# EAGLE design Train Servo Mark II (EAGLE 9.6.1)
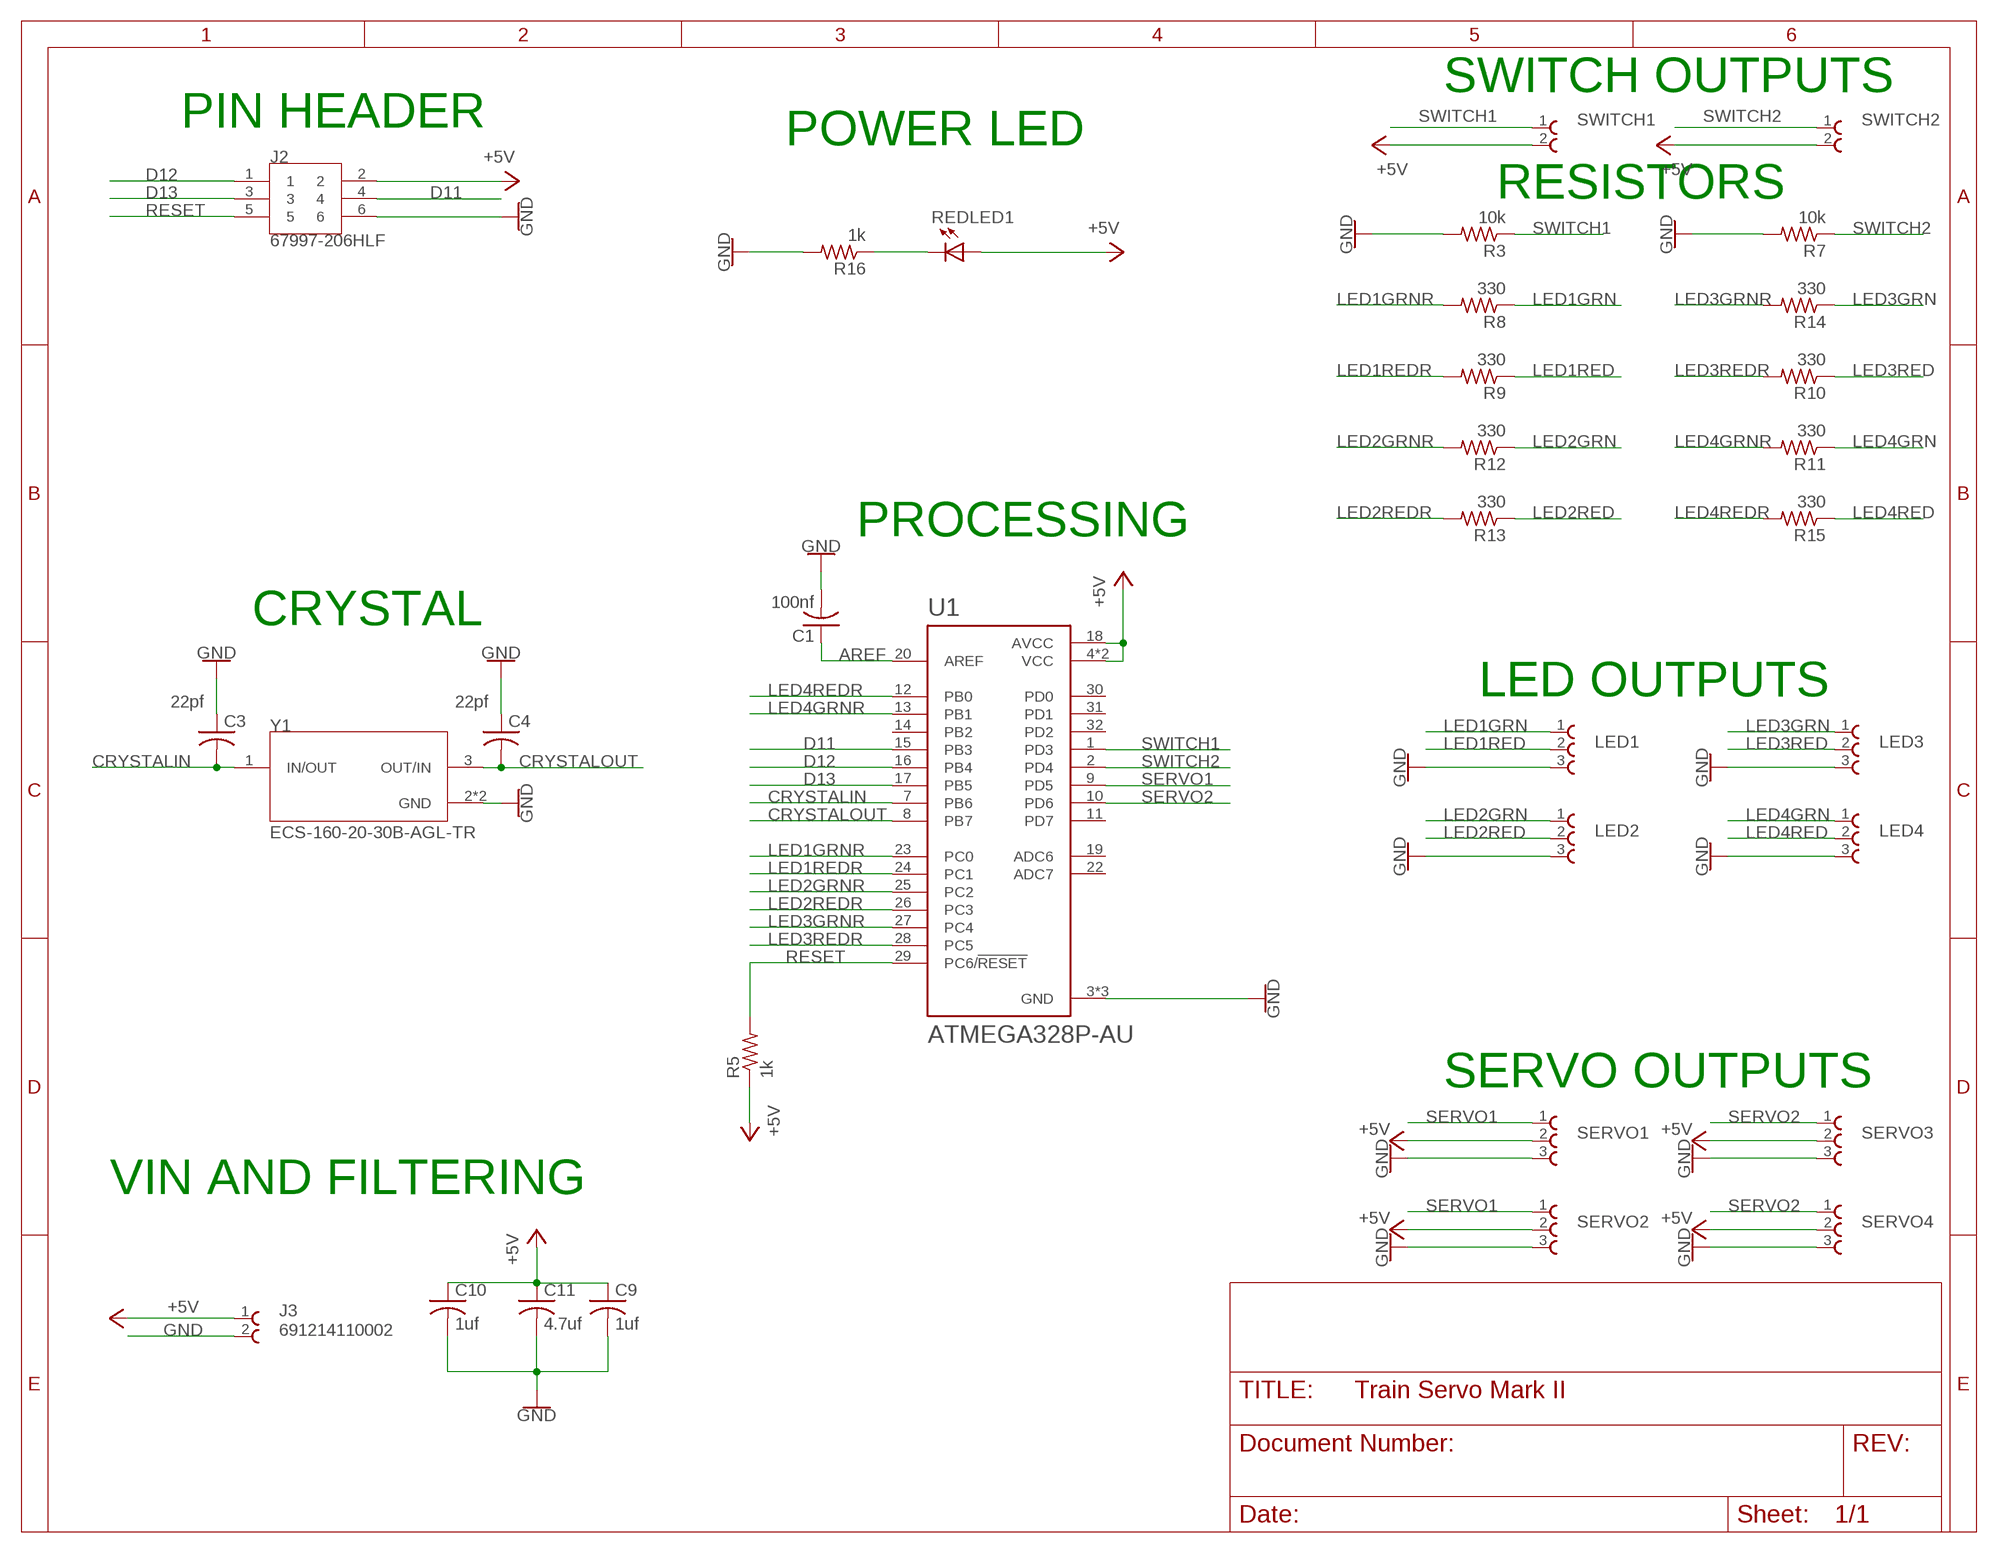
[diagram p0: schematic, sheet 1]

## Parts
C1  100nf  C-USC0805  [C0805]
C3  22pf  C-USC0805  [C0805]
C4  22pf  C-USC0805  [C0805]
C9  1uf  C-USC0805  [C0805]
C10  1uf  C-USC0805  [C0805]
C11  4.7uf  C-USC1206K  [C1206K]
J2  67997-206HLF  [FRAMATOME_67997-206HLF]
J3  691214110002  [691214110002]
LED1  691214110003  [691214110003]
LED2  691214110003  [691214110003]
LED3  691214110003  [691214110003]
LED4  691214110003  [691214110003]
R3  10k  R-US_M0805  [M0805]
R5  1k  R-US_M0805  [M0805]
R7  10k  R-US_M0805  [M0805]
R8  330  R-US_M0805  [M0805]
R9  330  R-US_M0805  [M0805]
R10  330  R-US_M0805  [M0805]
R11  330  R-US_M0805  [M0805]
R12  330  R-US_M0805  [M0805]
R13  330  R-US_M0805  [M0805]
R14  330  R-US_M0805  [M0805]
R15  330  R-US_M0805  [M0805]
R16  1k  R-US_M0805  [M0805]
REDLED1  LTST-C171KGKT  [DIOC200X125X110]
SERVO1  691214110003  [691214110003]
SERVO2  691214110003  [691214110003]
SERVO3  691214110003  [691214110003]
SERVO4  691214110003  [691214110003]
SWITCH1  691214110002  [691214110002]
SWITCH2  691214110002  [691214110002]
U1  ATMEGA328P-AU  [QFP80P900X900X120-32N]
Y1  ECS-160-20-30B-AGL-TR  [XTAL_ECS-160-20-30B-AGL-TR]

## Nets
+5V: C9.1 C10.1 C11.1 J2.2 J3.1 R5.1 REDLED1.+ SERVO1.2 SERVO2.2 SERVO3.2 SERVO4.2 SWITCH1.2 SWITCH2.2 U1.4(VCC) U1.6(VCC) U1.18(AVCC)
AREF: C1.1 U1.20(AREF)
CRYSTALIN: C3.2 U1.7(PB6) Y1.1(IN/OUT)
CRYSTALOUT: C4.2 U1.8(PB7) Y1.3(OUT/IN)
D11: J2.4 U1.15(PB3)
D12: J2.1 U1.16(PB4)
D13: J2.3 U1.17(PB5)
GND: C1.2 C3.1 C4.1 C9.2 C10.2 C11.2 J2.6 J3.2 LED1.3 LED2.3 LED3.3 LED4.3 R3.2 R7.2 R16.2 SERVO1.3 SERVO2.3 SERVO3.3 SERVO4.3 U1.3(GND) U1.5(GND) U1.21(GND) Y1.2(GND) Y1.4(GND)
LED1GRN: LED1.1 R8.1
LED1GRNR: R8.2 U1.23(PC0)
LED1RED: LED1.2 R9.1
LED1REDR: R9.2 U1.24(PC1)
LED2GRN: LED2.1 R12.1
LED2GRNR: R12.2 U1.25(PC2)
LED2RED: LED2.2 R13.1
LED2REDR: R13.2 U1.26(PC3)
LED3GRN: LED3.1 R14.1
LED3GRNR: R14.2 U1.27(PC4)
LED3RED: LED3.2 R10.1
LED3REDR: R10.2 U1.28(PC5)
LED4GRN: LED4.1 R11.1
LED4GRNR: R11.2 U1.13(PB1)
LED4RED: LED4.2 R15.1
LED4REDR: R15.2 U1.12(PB0)
N$3: R16.1 REDLED1.-
RESET: J2.5 R5.2 U1.29(PC6/!RESET)
SERVO1: SERVO1.1 SERVO2.1 U1.9(PD5)
SERVO2: SERVO3.1 SERVO4.1 U1.10(PD6)
SWITCH1: R3.1 SWITCH1.1 U1.1(PD3)
SWITCH2: R7.1 SWITCH2.1 U1.2(PD4)
Unconnected: U1.11(PD7) U1.14(PB2) U1.19(ADC6) U1.22(ADC7) U1.30(PD0) U1.31(PD1) U1.32(PD2)

## Notes on the sheet
- SWITCH OUTPUTS
- PIN HEADER
- POWER LED
- RESISTORS
- PROCESSING
- CRYSTAL
- LED OUTPUTS
- SERVO OUTPUTS
- VIN AND FILTERING

## Library data of the parts
C1 C3 C4 C9-C11 = adafruit:C-US: CAPACITOR, American symbol
J2 = 67997-206HLF:67997-206HLF: Conn; Rect; UnshroudedHdr; 6Cnts; ThruHole; BergStik; 2.54mmPin-Spng; Vert; DblRow; AVAILABILITY: Unavailable; DESCRIPTION: Connector Header Through Hole 6 position 0.100 _2.54mm_; MF: Amphenol ICC; MP: 67997-206HLF; PACKAGE: None; PRICE: None
J3 SWITCH1 SWITCH2 = 691214110002:691214110002: WR-TBL Serie 2141 - 3.5mm Horizontal Entry Modular with Rising Cage Clamp - 1.3 mm2 Wires, 2 Pins=>Code : Con_TBL_Screw_RisingClamp_3.50_691214110002 <http://katalog.we-online.de/media/images/eican/Con_TBL_Screw_RisingClamp_3.50_6912141100xx_pf2.jpg> Details see: http://katalog.we-online.de/en/em/TBL_3_50_2141_HORIZONTAL_ENTRY_MODULAR_69121411000X Created 2014-06-18, Karrer Zheng 2014 (C) Würth Elektronik; AVAILABILITY: Unavailable; DESCRIPTION: 2 Position Wire to Board Terminal Block Horizontal with Board 0.138 _3.50mm_ Through Hole; MF: Wurth Electronics; MP: 691214110002; PACKAGE: None; PRICE: None
LED1-LED4 SERVO1-SERVO4 = 691214110003:691214110003: WR-TBL Serie 2141 - 3.5mm Horizontal Entry Modular with Rising Cage Clamp - 1.3 mm2 Wires, 3 Pins=>Code : Con_TBL_Screw_RisingClamp_3.50_691214110003 <http://katalog.we-online.de/media/images/eican/Con_TBL_Screw_RisingClamp_3.50_6912141100xx_pf2.jpg> Details see: http://katalog.we-online.de/en/em/TBL_3_50_2141_HORIZONTAL_ENTRY_MODULAR_69121411000X Created 2014-06-18, Karrer Zheng 2014 (C) Würth Elektronik; AVAILABILITY: Unavailable; DESCRIPTION: 3 Position Wire to Board Terminal Block Horizontal with Board 0.138 _3.50mm_ Through Hole; MF: Wurth Electronics; MP: 691214110003; PACKAGE: None; PRICE: None
R3 R5 R7-R16 = adafruit:R-US_: RESISTOR, American symbol
REDLED1 = LTST-C171KGKT:LTST-C171KGKT: Green 2 x 1.25 x 1.1 mm 130° Water Clear 35 mcd 2 V Surface Mount LED; AVAILABILITY: Unavailable; DESCRIPTION: Green 571nm LED Indication - Discrete 2V 0805 _2012 Metric_; MF: Lite-On Inc.; MP: LTST-C171KGKT; PACKAGE: 0805 Diodes Inc.; PRICE: None
U1 = ATMEGA328P-AU:ATMEGA328P-AU: ATmega Series 20 MHz 32 KB Flash 2 KB SRAM 8-Bit Microcontroller - TQFP-32; AVAILABILITY: Unavailable; DESCRIPTION: AVR AVR® ATmega Microcontroller IC 8-Bit 20MHz 32KB _16K x 16_ FLASH 32-TQFP _7x7_; MF: Microchip; MP: ATMEGA328P-AU; PACKAGE: TQFP-32 Microchip; PRICE: None
Y1 = ECS-160-20-30B-AGL-TR:ECS-160-20-30B-AGL-TR: The ECX-53B is a miniature SMD Crystal with a 3.2 x 5 mm footprint. This package is ideal for todays compact wireless applications where board space is critical.; AVAILABILITY: Unavailable; DESCRIPTION: 16MHz ±25ppm Crystal 20pF 50 Ohms 4-SMD, No Lead; MF: ECS Inc.; MP: ECS-160-20-30B-AGL-TR; PACKAGE: SMD-4 ECS Inc.; PRICE: None

## Board
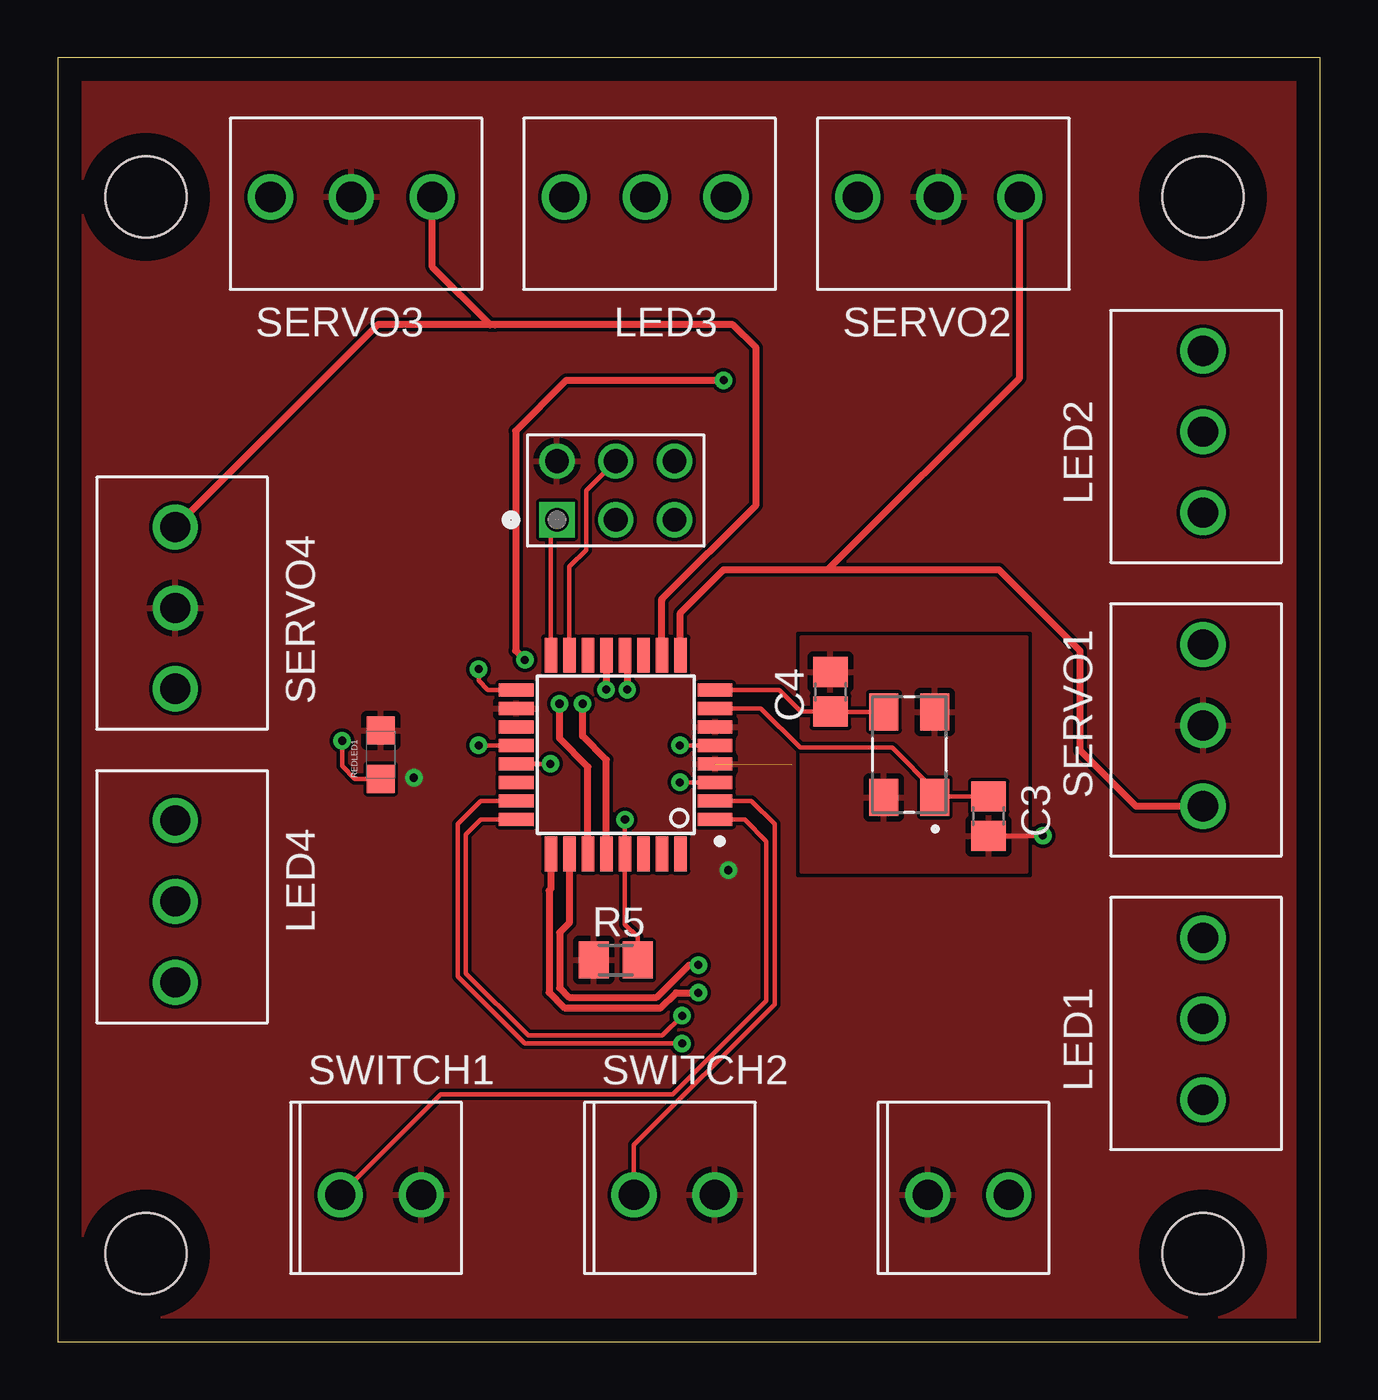
[diagram p1: board, top side]
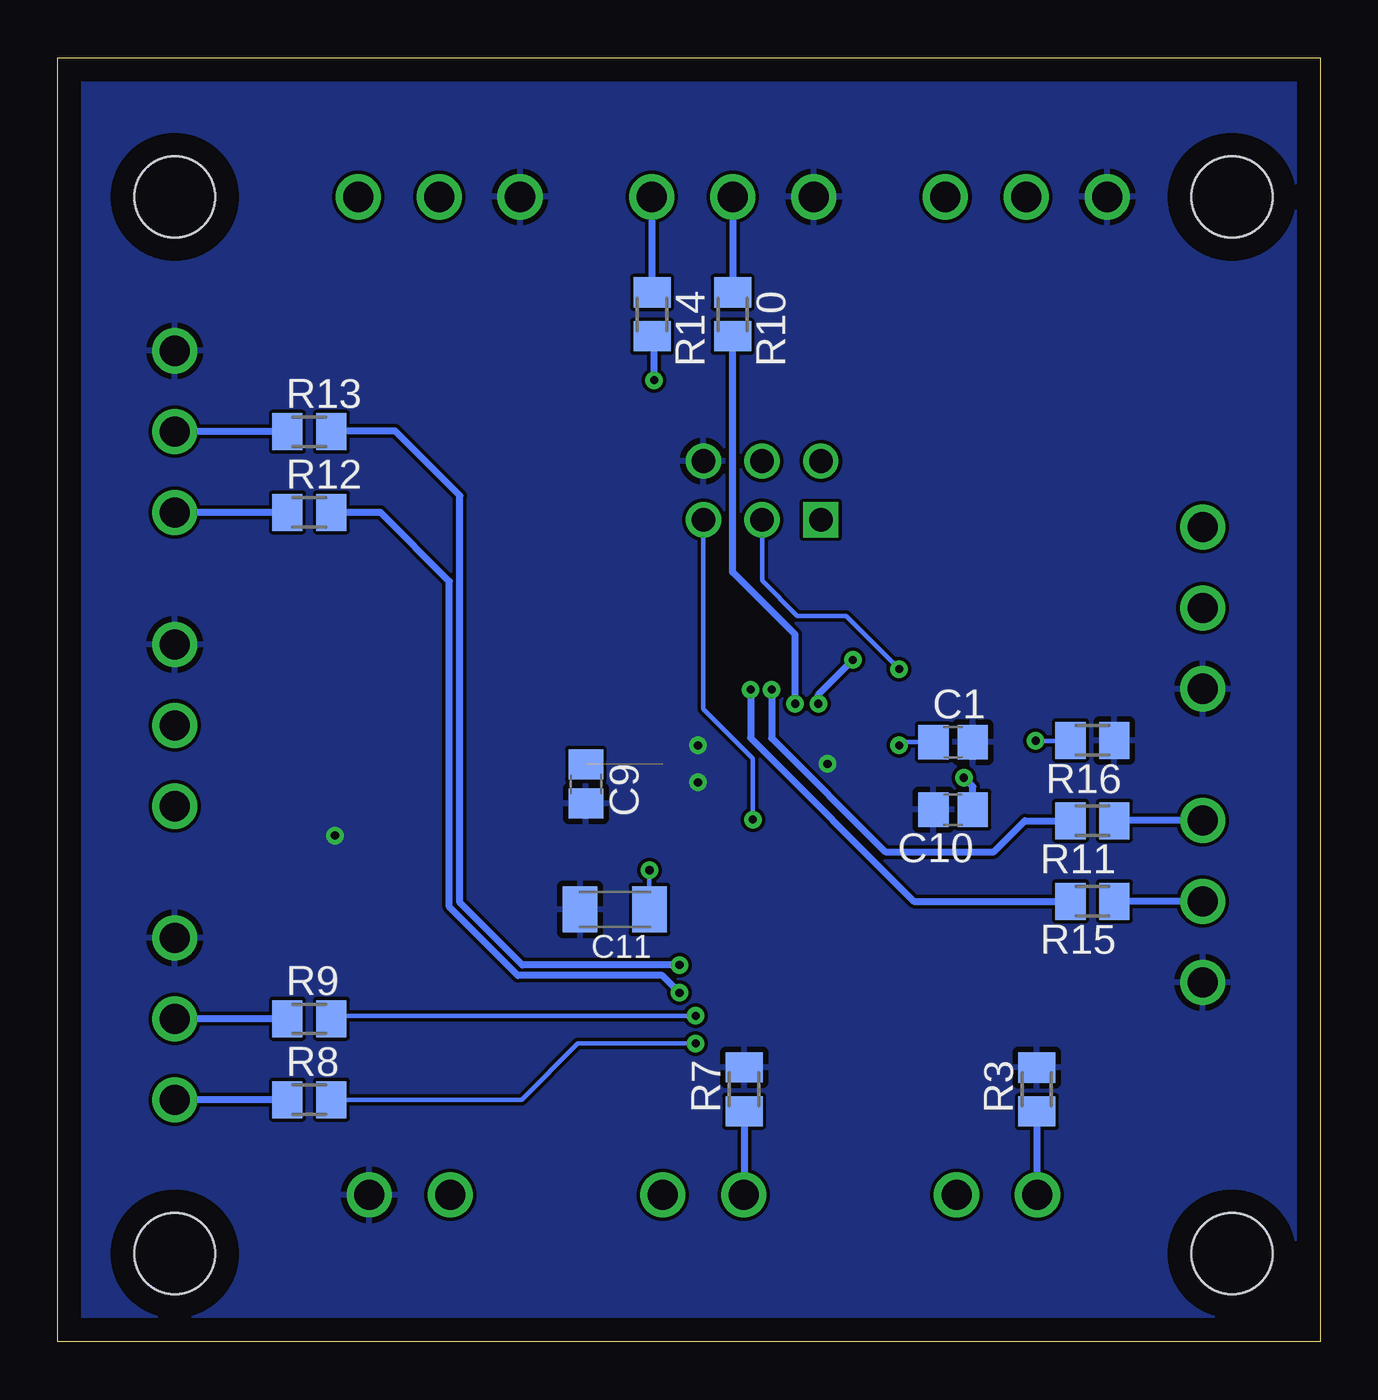
[diagram p2: board, bottom side, seen from below]

Size 54.59 x 55.55 mm. Coordinates in mm from the lower left corner, seen from the top.
Outline: 0,0 54.59,0 54.59,55.55 0,55.55 0,0
Copper layers (1*16): Top 0.035mm / dielectric 1.5mm / Bottom 0.035mm
Design rules "default": minimum track width 6mil, minimum drill 0.35mm, track to track 6mil, track to pad 6mil, pad to pad 6mil, via to via 6mil, smd to smd 6mil, copper to edge 40mil, drill to drill 6mil, minimum pad ring 10mil, minimum via ring 8mil, stop-mask expansion 4mil, vias tented up to drill 0mil, thermal gap 10mil
Holes 3.5 mm at 3.81,3.81 49.53,3.81 49.53,49.53 3.81,49.53

### Footprints (pad centres in the part's own frame; a part is rotated, then mirrored left to right if it is on the bottom)
C0805 = smd 1.3 x 1.5: 1 -0.85,0; 2 0.85,0
C1206K = smd 1.5 x 2: 1 -1.5,0; 2 1.5,0
FRAMATOME_67997-206HLF = drill 1.02 square: 1 -2.54,-1.27 | drill 1.02: 2 -2.54,1.27; 3 0,-1.27; 4 0,1.27; 5 2.54,-1.27; 6 2.54,1.27
691214110002 = drill 1.3: 1 -1.75,0; 2 1.75,0
691214110003 = drill 1.3: 1 -3.5,0; 2 0,0; 3 3.5,0
M0805 = smd 1.3 x 1.6: 1 -0.95,0; 2 0.95,0
DIOC200X125X110 = smd 1.2 x 1.2: + 1.05,0; - -1.05,0
QFP80P900X900X120-32N = smd 1.5 x 0.55: 1 -4.3,2.8; 2 -4.3,2; 3 -4.3,1.2; 4 -4.3,0.4; 5 -4.3,-0.4; 6 -4.3,-1.2; 7 -4.3,-2; 8 -4.3,-2.8; 17 4.3,-2.8; 18 4.3,-2; 19 4.3,-1.2; 20 4.3,-0.4; 21 4.3,0.4; 22 4.3,1.2; 23 4.3,2; 24 4.3,2.8 | smd 0.55 x 1.5: 9 -2.8,-4.3; 10 -2,-4.3; 11 -1.2,-4.3; 12 -0.4,-4.3; 13 0.4,-4.3; 14 1.2,-4.3; 15 2,-4.3; 16 2.8,-4.3; 25 2.8,4.3; 26 2,4.3; 27 1.2,4.3; 28 0.4,4.3; 29 -0.4,4.3; 30 -1.2,4.3; 31 -2,4.3; 32 -2.8,4.3
XTAL_ECS-160-20-30B-AGL-TR = smd 1.6 x 1.25: 1 -1.85,-1.1; 2 1.85,-1.1; 3 1.85,1.1; 4 -1.85,1.1

### Placement (x,y rotation side)
C1  15.87,25.94 0 bottom
C3  40.26,22.73 90 top
C4  33.42,28.12 270 top
C9  31.75,24.13 270 bottom
C10  15.87,23.02 180 bottom
C11  30.5,18.7 180 bottom
J2  24.13,36.83 0 top
J3  39.37,6.35 0 top
LED1  49.53,13.97 90 top
LED2  49.53,39.37 90 top
LED3  25.4,49.53 180 top
LED4  5.08,19.05 270 top
R3  12.25,10.91 90 bottom
R5  24.13,16.51 0 top
R7  24.91,10.92 90 bottom
R8  43.71,10.47 0 bottom
R9  43.71,13.97 0 bottom
R10  25.4,44.45 270 bottom
R11  9.84,22.54 180 bottom
R12  43.71,35.88 0 bottom
R13  43.71,39.37 0 bottom
R14  28.89,44.45 270 bottom
R15  9.84,19.06 180 bottom
R16  9.84,26.02 0 bottom
REDLED1  13.97,25.4 90 top
SERVO1  49.53,26.67 90 top
SERVO2  38.1,49.53 180 top
SERVO3  12.7,49.53 180 top
SERVO4  5.08,31.75 270 top
SWITCH1  13.97,6.35 0 top
SWITCH2  26.67,6.35 0 top
U1  24.13,25.4 180 top
Y1  36.83,25.4 90 top

### Tracks (layer width: path | path; a pad name or v marks a point on that pad's centre or on a via)
+5V  (via drill 0.35)  (1 unrouted)
  Bottom 0.2: C11.1 v29,20.4
  Bottom 0.3: C10.1 15.02,24.02 v15.4,24.4
  pour Top (rank 2): 0,55.88 54.61,55.88 54.61,0 0,0
AREF  (via drill 0.35)
  Top 0.2: v18.2,25.8 U1.20
  Bottom 0.2: C1.1 18.06,25.94 v18.2,25.8
CRYSTALIN
  Top 0.2: C3.2 37.96,23.58 Y1.1 37.93,23.85 36.08,25.7 32.1,25.7 30.4,27.4 U1.7
CRYSTALOUT
  Top 0.2: Y1.3 33.44,27.25 C4.2 32.13,27.27 31.2,28.2 U1.8
D11
  Top 0.2: U1.15 22.13,33.53 22.86,34.26 22.86,36.83 J2.4
D12
  Top 0.2: U1.16 21.33,35.3 J2.1
D13  (via drill 0.35)
  Top 0.2: U1.17 18.6,28.2 18.2,28.6 v18.2,29.1
  Bottom 0.2: v18.2,29.1 20.5,31.4 22.6,31.4 24.13,32.93 J2.3
GND  (via drill 0.35)
  Top 0.2: C3.1 42.58,21.88 v42.6,21.9 | U1.3 v26.9,24.2 | U1.5 v26.9,25.8 | U1.21 v21.3,25
  pour Top: 32.15,20.32 41.91,20.32 41.91,30.48 32.15,30.48
  pour Bottom: 0,55.88 54.61,55.88 54.61,0 0,0
LED1GRN
  Bottom 0.3: R8.1 LED1.1
LED1GRNR  (via drill 0.35)
  Top 0.2: U1.23 18.3,23.4 17.3,22.4 17.3,15.8 20.2,12.9 v27,12.9
  Bottom 0.2: v27,12.9 32.1,12.9 34.53,10.47 R8.2
LED1RED
  Bottom 0.3: R9.1 LED1.2
LED1REDR  (via drill 0.35)
  Top 0.2: U1.24 18.3,22.6 17.65,21.95 17.65,15.95 20.35,13.25 26.15,13.25 v27,14.1
  Bottom 0.2: v27,14.1 42.63,14.1 R9.2
LED2GRN
  Bottom 0.3: R12.1 LED2.1
LED2GRNR  (via drill 0.35)
  Top 0.3: U1.25 21.33,19.6 21.25,19.52 21.25,15.11 21.91,14.45 26.09,14.45 26.74,15.1 v27.7,15.1
  Bottom 0.3: v27.7,15.1 28.45,15.85 34.69,15.85 37.65,18.81 37.65,32.9 40.63,35.88 R12.2
LED2RED
  Bottom 0.3: R13.1 LED2.2
LED2REDR  (via drill 0.35)
  Top 0.3: U1.26 22.13,18.13 21.7,17.7 21.7,15.3 22.1,14.9 25.9,14.9 27.3,16.3 v27.7,16.3
  Bottom 0.3: v27.7,16.3 34.5,16.3 37.2,19 37.2,36.6 40,39.4 42.73,39.4 R13.2
LED3GRN
  Bottom 0.3: LED3.1 R14.1
LED3GRNR  (via drill 0.35)
  Top 0.3: U1.27 22.93,24.87 21.7,26.1 v21.7,27.6 | v20.2,29.5 19.8,29.9 19.8,39.4 22,41.6 v28.8,41.6
  Bottom 0.3: v21.7,27.6 21.7,28 v20.2,29.5 | v28.8,41.6 28.8,43.41 R14.2
LED3RED
  Bottom 0.3: LED3.2 R10.1
LED3REDR  (via drill 0.35)
  Top 0.3: U1.28 23.73,25.17 22.7,26.2 v22.7,27.6
  Bottom 0.3: v22.7,27.6 22.7,30.6 25.4,33.3 R10.2
LED4GRN
  Bottom 0.3: LED4.1 R11.1
LED4GRNR  (via drill 0.35)
  Top 0.3: U1.13 v23.73,28.22 v23.72,28.21
  Bottom 0.3: v23.72,28.21 23.72,26.12 18.8,21.2 14.1,21.2 12.76,22.54 R11.2
LED4RED
  Bottom 0.3: LED4.2 R15.1
LED4REDR  (via drill 0.35)
  Top 0.3: U1.12 24.63,29.6 v24.63,28.21
  Bottom 0.3: v24.63,28.21 24.63,26.13 17.56,19.06 R15.2
N$3  (via drill 0.35)
  Top 0.2: REDLED1.- 12.85,24.35 12.3,24.9 v12.3,26
  Bottom 0.2: v12.3,26 10.81,26 R16.1
RESET  (via drill 0.35)
  Top 0.2: R5.2 25.08,17.51 24.53,18.06 U1.29 v24.53,22.59
  Bottom 0.2: v24.53,22.59 24.53,25.23 26.68,27.38 J2.5
SERVO1
  Top 0.3: U1.9 26.93,31.53 28.8,33.4 33.1,33.4 33.3,33.4 | 33.3,33.4 41.6,41.7 SERVO2.1 | 33.3,33.4 40.7,33.4 44.2,29.9 44.2,25.6 46.63,23.17 SERVO1.1
SERVO2
  Top 0.3: U1.10 26.13,32.07 26.1,32.1 30.2,36.2 30.2,43 29.2,44 18.9,44 18.7,44 | 18.7,44 16.2,46.5 SERVO3.1 | 18.7,44 13.83,44 SERVO4.1
SWITCH1
  Top 0.2: U1.1 29.7,22.6 30.65,21.65 30.65,14.75 26.6,10.7 16.57,10.7 SWITCH1.1
  Bottom 0.3: R3.1 12.25,6.38 SWITCH1.1
SWITCH2
  Top 0.2: U1.2 30,23.4 31,22.4 31,14.6 24.92,8.52 SWITCH2.1
  Bottom 0.3: R7.1 SWITCH2.1